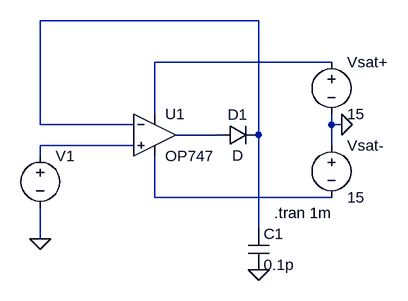
[diagram p0: schematic CLIPPER_NEG.asc]
CLIPPER_NEG.asc, the LTspice schematic file:
Version 4
SHEET 1 1584 680
WIRE 544 -16 208 -16
WIRE 656 48 384 48
WIRE 384 128 384 48
WIRE 208 144 208 -16
WIRE 352 144 208 144
WIRE 656 144 656 128
WIRE 672 144 656 144
WIRE 480 160 416 160
WIRE 544 160 544 -16
WIRE 352 176 208 176
WIRE 656 176 656 144
WIRE 208 192 208 176
WIRE 384 256 384 192
WIRE 656 256 384 256
WIRE 544 304 544 160
WIRE 208 320 208 272
FLAG 672 144 0
FLAG 208 320 0
FLAG 544 368 0
SYMBOL OpAmps\\OP747 384 96 R0
SYMATTR InstName U1
SYMBOL voltage 656 32 R0
WINDOW 123 0 0 Left 0
WINDOW 39 0 0 Left 0
SYMATTR InstName Vsat+
SYMATTR Value 15
SYMBOL voltage 656 160 R0
WINDOW 123 0 0 Left 0
WINDOW 39 0 0 Left 0
SYMATTR InstName Vsat-
SYMATTR Value 15
SYMBOL diode 480 176 R270
WINDOW 0 32 32 VTop 2
WINDOW 3 0 32 VBottom 2
SYMATTR InstName D1
SYMBOL cap 528 304 R0
SYMATTR InstName C1
SYMATTR Value 0.1p
SYMBOL voltage 208 176 R0
WINDOW 3 24 96 Invisible 2
WINDOW 123 0 0 Left 0
WINDOW 39 0 0 Left 0
SYMATTR InstName V1
SYMATTR Value PWL(0 0 0.09m 1 0.18m -2 0.27m 2.5 0.36m 1.25 0.45m -2 0.54m -3 0.63m 2.5 0.72m 4.6 0.81m -1 0.9m 0 0.99m 2)
TEXT 568 280 Left 2 !.tran 1m

The netlist it stands for:
* CLIPPER_NEG.asc
XU1 N004 N001 N002 N005 N003 OP747  ; pins In+ In- V+ V- OUT
Vsat+ N002 0 15
Vsat- 0 N005 15
D1 N003 N001 D
C1 N001 0 0.1p
V1 N004 0 PWL(0 0 0.09m 1 0.18m -2 0.27m 2.5 0.36m 1.25 0.45m -2 0.54m -3 0.63m 2.5 0.72m 4.6 0.81m -1 0.9m 0 0.99m 2)
.model D D
.lib standard.dio
.tran 1m
.backanno
.end